# EAGLE design aspirin (EAGLE 6.1)
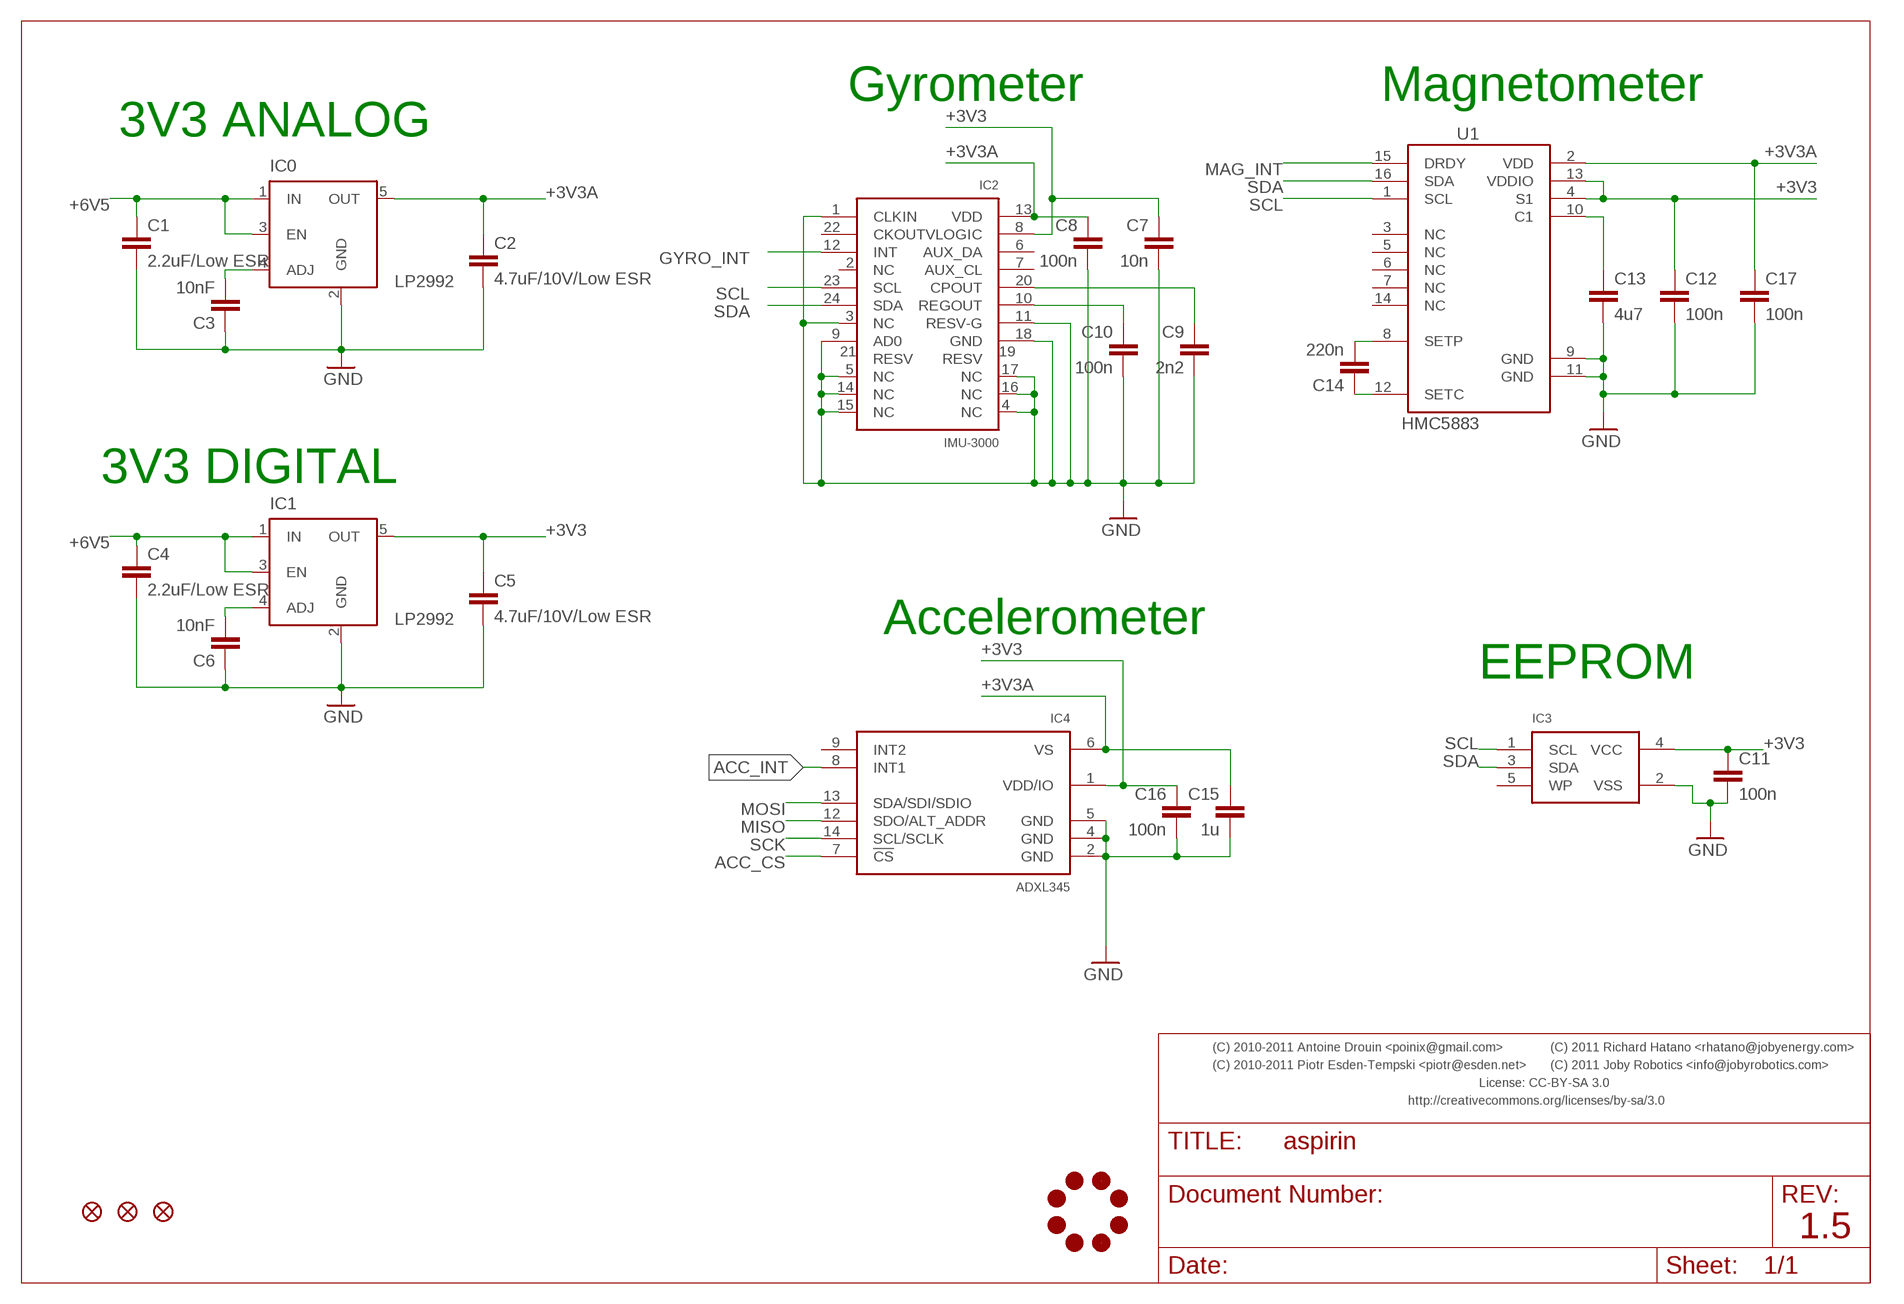
[diagram p0: schematic, sheet 1]

## Parts
C1  2.2uF/Low ESR  CAPACITOR-0603  [0603-CAP]
C2  4.7uF/10V/Low ESR  CAPACITOR-0402  [0402-CAP]
C3  10nF  CAPACITOR-0402  [0402-CAP]
C4  2.2uF/Low ESR  CAPACITOR-0603  [0603-CAP]
C5  4.7uF/10V/Low ESR  CAPACITOR-0402  [0402-CAP]
C6  10nF  CAPACITOR-0402  [0402-CAP]
C7  10n  CAPACITOR-0402  [0402-CAP]
C8  100n  CAPACITOR-0402  [0402-CAP]
C9  2n2  CAPACITOR-0402  [0402-CAP]
C10  100n  CAPACITOR-0402  [0402-CAP]
C11  100n  CAPACITOR-0402  [0402-CAP]
C12  100n  CAPACITOR-0402  [0402-CAP]
C13  4u7  CAPACITOR-0402  [0402-CAP]
C14  220n  CAPACITOR-0402  [0402-CAP]
C15  1u  CAPACITOR-0402  [0402-CAP]
C16  100n  CAPACITOR-0402  [0402-CAP]
C17  100n  CAPACITOR-0402  [0402-CAP]
IC0  LP2992  MIC5219BM5  [SOT23-5]
IC1  LP2992  MIC5219BM5  [SOT23-5]
IC2  IMU-3000  [QFN24-IMU3000]
IC3  I2C_EEPROM-SOT23-5  [SOT23-5]
IC4  ADXL345  [LGA-14]
JL2  JOBY_LOGO-6MIL  [JOBY_LOGO_6MIL]
JP1  FIDUCIAL1X2  [FIDUCIAL-1X2]
JP2  FIDUCIAL1X2  [FIDUCIAL-1X2]
JP3  FIDUCIAL1X2  [FIDUCIAL-1X2]
U1  HMC5883  [PLCC16-HMC5883]

## Nets
+3V3: C5.P$1 C7.P$1 C11.P$1 C12.P$1 C16.P$1 IC1.5(OUT) IC2.8(VLOGIC) IC3.4(VCC) IC4.1(VDD/IO) U1.4(S1) U1.13(VDDIO)
+3V3A: C2.P$1 C8.P$1 C15.P$1 C17.P$1 IC0.5(OUT) IC2.13(VDD) IC4.6(VS) U1.2(VDD)
+6V5: C1.P$1 C4.P$1 IC0.1(IN) IC0.3(EN) IC1.1(IN) IC1.3(EN)
ACC_CS: IC4.7(!CS)
ACC_INT: IC4.8(INT1)
GND: C1.P$2 C2.P$2 C3.P$1 C4.P$2 C5.P$2 C6.P$1 C7.P$2 C8.P$2 C9.P$2 C10.P$2 C11.P$2 C12.P$2 C13.P$2 C15.P$2 C16.P$2 C17.P$2 IC0.2(GND) IC1.2(GND) IC2.1(CLKIN) IC2.3(NC) IC2.4(NC) IC2.5(NC) IC2.9(AD0) IC2.11(RESV-G) IC2.14(NC) IC2.15(NC) IC2.16(NC) IC2.17(NC) IC2.18(GND) IC3.2(VSS) IC4.2(GND) IC4.4(GND) IC4.5(GND) U1.9(GND) U1.11(GND)
GYRO_INT: IC2.12(INT)
MAG_INT: U1.15(DRDY)
MISO: IC4.12(SDO/ALT_ADDR)
MOSI: IC4.13(SDA/SDI/SDIO)
N$1: C9.P$1 IC2.20(CPOUT)
N$2: C10.P$1 IC2.10(REGOUT)
N$3: C13.P$1 U1.10(C1)
N$19: C6.P$2 IC1.4(ADJ)
N$23: C3.P$2 IC0.4(ADJ)
N$34: C14.P$2 U1.8(SETP)
N$48: C14.P$1 U1.12(SETC)
SCK: IC4.14(SCL/SCLK)
SCL: IC2.23(SCL) IC3.1(SCL) U1.1(SCL)
SDA: IC2.24(SDA) IC3.3(SDA) U1.16(SDA)
Unconnected: IC2.2(NC) IC2.6(AUX_DA) IC2.7(AUX_CL) IC2.19(RESV) IC2.21(RESV) IC2.22(CKOUT) IC3.5(WP) IC4.9(INT2) U1.3(NC) U1.5(NC) U1.6(NC) U1.7(NC) U1.14(NC)

## Notes on the sheet
- Gyrometer | Magnetometer
- 3V3 ANALOG
- 3V3 DIGITAL
- Accelerometer
- EEPROM
- (C) 2010-2011 Antoine Drouin <poinix@gmail.com> | (C) 2011 Richard Hatano <rhatano@jobyenergy.com>
- (C) 2010-2011 Piotr Esden-Tempski <piotr@esden.net> | (C) 2011 Joby Robotics <info@jobyrobotics.com>
- License: CC-BY-SA 3.0
- http://creativecommons.org/licenses/by-sa/3.0
- 1.5

## Library data of the parts
C1-C17 = pel_dipol_comp:CAPACITOR
IC0 IC1 = v-reg-micrel:MIC5219BM5: VOLTAGE REGULATOR
IC2 = aspirin:IMU-3000
IC3 = aspirin:I2C_EEPROM
IC4 = aspirin:ADXL345
JL2 = aspirin:JOBY_LOGO
JP1-JP3 = aspirin:FIDUCIAL: Fiducial Alignment Points Various fiducial points for machine vision alignment.
U1 = aspirin:HMC5883

## Board
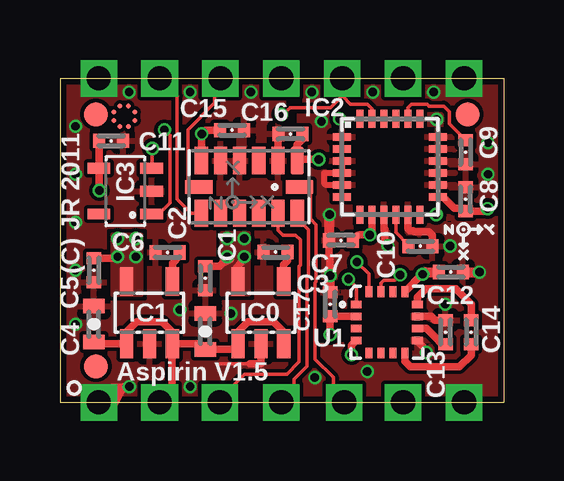
[diagram p1: board, top side]
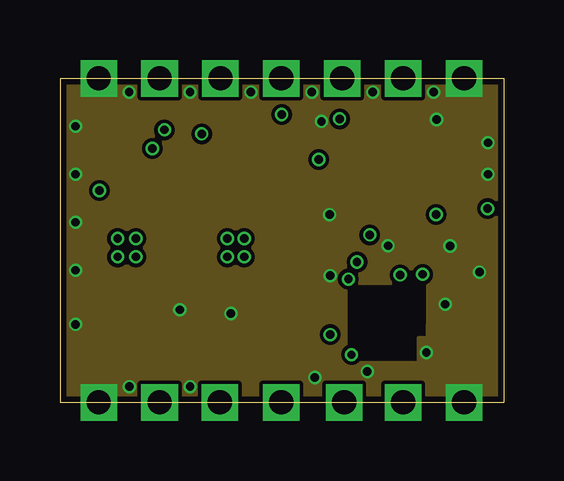
[diagram p2: board, inner layer Route2]
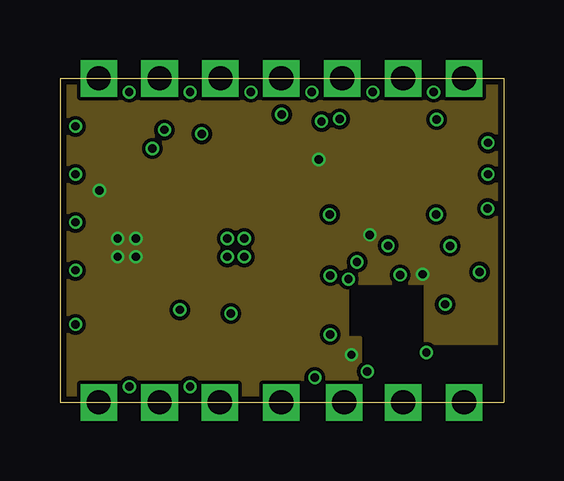
[diagram p3: board, inner layer Route15]
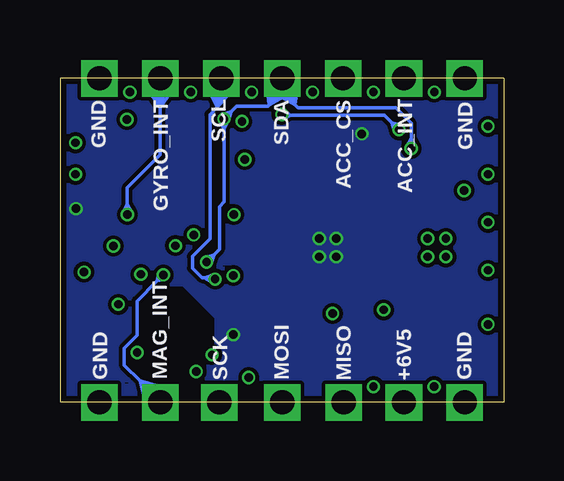
[diagram p4: board, bottom side, seen from below]

Size 18.5 x 13.5 mm. Coordinates in mm from the lower left corner, seen from the top.
Outline: 0,13.5 0,0 18.5,0 18.5,13.5 0,13.5
Copper layers (1*2+15*16): Top 0.035mm / dielectric 0.2mm / Route2 0.035mm / dielectric 1.5mm / Route15 0.035mm / dielectric 0.2mm / Bottom 0.035mm
Design rules: minimum track width 0.15mm, minimum drill 0.35mm, track to track 6mil, track to pad 6mil, pad to pad 6mil, via to via 6mil, smd to smd 6mil, copper to edge 10mil, drill to drill 8mil, minimum pad ring 0.1mm, minimum via ring 0.1mm, stop-mask expansion 4mil, vias tented up to drill 0.35mm, thermal gap 10mil
tRestrict: area 8.5,6.7 to 8.7,6.7; area 16.2,7.5 to 16.3,7.5; area 12.3,8.4 to 15.2,11.2; area 9.8,11.8 to 9.9,11.9; area 11.7,2.5 to 11.8,2.5; area 12.7,2.3 to 14.6,4.3; area 11.7,4.5 to 11.7,4.7
bRestrict: area 11.6,5.7 to 11.7,5.7; area 15.7,0.8 to 15.8,0.8; area 12.1,1.8 to 15,4.7
vRestrict: area 12.7,2.3 to 14.6,4.3

### Footprints (pad centres in the part's own frame; a part is rotated, then mirrored left to right if it is on the bottom)
0603-CAP = smd 0.6 x 0.9: P$1 -0.75,0; P$2 0.75,0
0402-CAP = smd 0.5 x 0.6: P$1 -0.5,0; P$2 0.5,0
SOT23-5 = smd 0.55 x 1.2: 1 -0.95,-1.3; 2 0,-1.3; 3 0.95,-1.3; 4 0.95,1.3; 5 -0.95,1.3
QFN24-IMU3000 = smd 0.75 x 0.3: 1 -2,1.25; 2 -2,0.75; 3 -2,0.25; 4 -2,-0.25; 5 -2,-0.75; 6 -2,-1.25; 13 2,-1.25; 14 2,-0.75; 15 2,-0.25; 16 2,0.25; 17 2,0.75; 18 2,1.25 | smd 0.3 x 0.75: 7 -1.25,-2; 8 -0.75,-2; 9 -0.25,-2; 10 0.25,-2; 11 0.75,-2; 12 1.25,-2; 19 1.25,2; 20 0.75,2; 21 0.25,2; 22 -0.25,2; 23 -0.75,2; 24 -1.25,2
SOT23-5' = smd 0.45 x 0.95: 1 0.95,1.1; 2 0,1.1; 3 -0.95,1.1; 4 -0.95,-1.1; 5 0.95,-1.1
LGA-14 = smd 1.145 x 0.55: 1 -1.097,2; 2 -1.097,1.2; 3 -1.097,0.4; 4 -1.097,-0.4; 5 -1.097,-1.2; 6 -1.097,-2; 8 1.097,-2; 9 1.097,-1.2; 10 1.097,-0.4; 11 1.097,0.4; 12 1.097,1.2; 13 1.097,2 | smd 0.55 x 1.145: 7 0,-2.098; 14 0,2.098
JOBY_LOGO_6MIL = smd 0.203 x 0.203: 1 -0.178,0.432; 2 0.178,0.432; 3 0.432,0.178; 4 0.432,-0.178; 5 0.178,-0.432; 6 -0.178,-0.432; 7 -0.432,-0.178; 8 -0.432,0.178
FIDUCIAL-1X2 = smd 1 x 1: 1 0,0
PLCC16-HMC5883 = smd 0.45 x 0.3: 1 -1.275,0.75; 2 -1.275,0.25; 3 -1.275,-0.25; 4 -1.275,-0.75; 9 1.275,-0.75; 10 1.275,-0.25; 11 1.275,0.25; 12 1.275,0.75 | smd 0.3 x 0.45: 5 -0.75,-1.275; 6 -0.25,-1.275; 7 0.25,-1.275; 8 0.75,-1.275; 13 0.75,1.275; 14 0.25,1.275; 15 -0.25,1.275; 16 -0.75,1.275

### Placement (x,y rotation side)
C1  6.06,2.95 90 top
C2  6.06,5.16 270 top
C3  9,6.26 0 top
C4  1.42,3.26 90 top
C5  1.42,5.49 270 top
C6  4.5,6.25 0 top
C7  11.72,6.75 180 top
C8  16.92,8.47 90 top
C9  16.92,10.42 270 top
C10  15.04,6.5 0 top
C11  2.13,10.9 0 top
C12  16.31,5.43 0 top
C13  16.08,2.93 90 top
C14  17.15,2.93 270 top
C15  7.18,11.34 0 top
C16  9.62,11.18 180 top
C17  11.27,4.09 90 top
DRILEGEND  [DRILEGEND]  -1.02,-7.68 0 top  (outside the outline)
IC0  8.38,3.73 0 top
IC1  3.73,3.73 0 top
IC2  13.76,9.8 0 top
IC3  [SOT23-5']  2.73,8.8 270 top
IC4  7.89,8.97 270 top
JL2  2.69,11.92 0 top
JP1  1.5,12 0 top
JP2  17,12 0 top
JP3  1.5,1.5 0 top
U1  13.63,3.33 0 top

### Tracks (layer width: path | path; a pad name or v marks a point on that pad's centre or on a via)
+3V3  (via drill 0.35)
  Top 0.305: v10.79,10.12 9.94,10.12 IC4.1 9.89,10.73 10.12,10.96 C16.P$1 | v1.64,8.82 1.64,9.73 IC3.4 1.63,10.89 C11.P$1 | C7.P$1 12.42,6.95 12.5,6.98 v12.92,6.98 | v12.92,6.98 13.01,7.07 | C5.P$1 2.34,5.99 v2.41,6.06 | U1.13 14.39,4.61 15.1,5.33 v15.13,5.33 | v12.16,1.98 12.16,2.38 U1.4 | IC2.8 13.01,7.06 v12.92,6.98
  Top 0.406: C12.P$1 15.22,5.42 v15.13,5.33
  other vias: 3.17,6.06 2.41,6.83 3.17,6.83
  pour Route15: 0,0 18.52,0 18.52,2.5 14.92,2.5 14.92,1.65 12.52,1.65 12.52,2.65 11.97,2.65 11.97,5 15.27,5 15.27,4.4 18.5,4.4 18.5,13.5 0,13.5
  pour Top (no thermals): 3.4,4.46 2.18,4.46 2.18,7 3.4,7
  pour Route15: 18.52,2.5 18.52,4.4 15.27,4.4 15.27,2.5
+3V3A  (via drill 0.35)
  Top 0.305: v7.69,6.06 7.52,5.77 | 7.52,5.77 7.36,5.61 | C2.P$1 6.65,5.66 6.76,5.77 | 6.76,5.77 v6.98,6.06 | 17.43,7.97 C8.P$1 16.92,8.02 16.86,8.08 16.45,8.08 15.97,8.55 IC2.13 | 17.43,7.97 17.73,7.97 v17.83,8.07 17.83,7.95 17.43,7.97 | 6.76,5.77 7.11,5.96 v6.98,6.06 | 6.76,5.77 6.95,6.12 v6.98,6.06 | v7.69,6.06 7.75,5.96 | 7.52,5.77 7.71,6.12 v7.69,6.06 | U1.2 11.31,3.58 C17.P$1 v11.27,2.82 | IC4.6 5.9,10.1 v5.9,11.17 v5.91,11.18 6.06,11.34 C15.P$1
  other vias: 7.69,6.83 6.98,6.83
  pour Bottom: 18.5,0 18.5,13.5 0,13.5 0,0
  pour Top (no thermals): 7.89,4.48 6.75,4.48 6.75,7.07 7.89,7.07
+6V5  (via drill 1.02)
  Top 0.305: IC0.3 9.33,2.94 8.92,3.35 7.85,3.35 7.43,2.94 IC0.1 7.2,2.2 C1.P$1 5.83,2.43 IC1.3 | IC1.3 4.68,2.94 4.27,3.35 3.2,3.35 2.78,2.94 IC1.1 1.49,2.43 C4.P$1 | IC1.3 4.68,0.53 v4.16,0
ACC_CS  (via drill 1.02)
  Top 0.152: v6.7,13.5 6.46,13.26 6.46,12.47 5.33,11.35 5.33,9.16 5.52,8.97 IC4.7
ACC_INT  (via drill 1.02)
  Top 0.152: IC4.8 5.47,7.88 4.89,8.46 4.89,12.76 v4.16,13.5
GND  (via drill 0.35, 1.02)
  Top 0.152: 6.68,1.6 7.93,1.6
  Top 0.254: IC2.3 IC2.4 11.01,9.55 11.01,9.12 11.07,9.07 11.75,9.07
  Top 0.305: 2.65,0.65 v2.89,0.65 | 2.65,0.65 2.63,0.65 | IC0.2 8.38,1.6 7.93,1.6 | C16.P$2 9.09,11.05 IC4.2 | IC2.9 13.51,7.26 13.55,7.21 | 13.55,6.92 13.55,6.65 v13.68,6.52 13.56,6.52 13.55,6.92 | 13.55,6.92 13.55,7.21 | 13.55,7.21 13.53,7.21 13.5,7.19 | 2.65,0.65 1.59,0.61 v1.62,0 2.16,-0.28 2.65,0.65 | IC2.11 14.51,7.23 14.6,7.14 14.75,7.14 14.77,7.11 15.38,7.11 15.54,6.96 C10.P$2 | v11.27,5.28 11.27,6.02 11.22,6.07 C7.P$2 | U1.9 14.91,2.54 15.28,2.16 15.28,2.08 | U1.11 15.49,3.58 15.64,3.43 C13.P$2
  Top 0.406: C12.P$2 v17.49,5.42 | C17.P$2 v11.27,5.28 | v11.24,7.82 11.24,6.78 C7.P$2
  other vias: 5,3.85 7.13,3.7 17.85,9.5 17.85,10.81 16.27,6.51 0.65,3.25 0.65,5.5 0.65,7.5 0.65,9.5 0.65,11.5 2.89,12.92 5.43,12.92 7.97,12.92 13.05,12.92 15.59,12.92 10.63,1.03 5.43,0.65 1.62,13.5 16.86,13.5 16.86,0 10.51,12.92 15.71,11.78 10.91,11.7 16.07,4.08 12.82,1.28 15.28,2.07
  pour Top (rank 6): 0,0 18.5,0 18.5,13.5 0,13.5
  pour Route2: 0,0 18.52,0 18.52,2.65 14.97,2.65 14.97,1.6 11.92,1.6 11.92,5 15.32,5 15.32,4.95 15.37,4.95 15.37,3.3 18.52,3.3 18.5,13.5 0,13.5
  pour Route2: 18.52,2.65 15.37,2.65 15.37,3.25 18.52,3.25
GYRO_INT  (via drill 0.35, 1.02)
  Top 0.152: IC2.12 15.67,7.8 v15.69,7.82
  Bottom 0.152: v15.69,7.82 15.69,8.24 | 15.69,8.24 15.69,8.94 14.32,10.31 14.32,12.28 | 14.32,12.28 14.32,12.34 | 14.32,12.34 v14.32,13.5 | 14.32,12.28 14.88,13.11 v14.32,13.5 | 14.32,12.28 13.75,13.11 v14.32,13.5 | 15.69,8.24 15.51,7.92 v15.69,7.82 | 15.69,8.24 15.86,7.92 v15.69,7.82 | 14.32,12.34 14.11,12.93 | 14.32,12.34 14.52,12.88
MAG_INT  (via drill 0.35, 1.02)
  Top 0.152: U1.15 13.38,4.96 13.5,5.08 13.96,5.08 v14.19,5.31
  Bottom 0.152: v14.19,5.31 14.44,5.05 | 14.44,5.05 14.37,5.38 v14.19,5.31 | 14.44,5.05 14.11,5.13 v14.19,5.31 | v14.32,0 14.32,0.05 14.34,0.08 | 15.15,0.89 14.34,0.08 | 15.15,0.89 15.82,1.55 15.82,2.26 15.28,2.79 15.28,4.22 14.44,5.05 | 15.15,0.89 15,0.3 14.34,0.08 | 15.15,0.89 14.44,0.69 14.34,0.08
MISO  (via drill 1.02)
  Top 0.152: v6.67,0 6.67,0.15 7.69,1.18 9.47,1.18 9.98,1.68 9.98,5.67 10.03,5.72 10.03,6.76 9.83,6.96 9.3,6.96 9.09,7.16 IC4.12
MOSI  (via drill 1.02)
  Top 0.152: IC4.13 9.89,7.66 10.36,7.2 10.36,5.31 10.3,5.26 10.3,1.5 9.75,0.95 9.75,0.51 v9.24,0
N$1
  Top 0.152: C9.P$1 16.23,11.61 16.23,12.12 16,12.34 15.39,12.34 15.32,12.42 14.66,12.42 14.51,12.27 IC2.20
N$2
  Top 0.152: IC2.10 14.01,7.08 14.54,6.55 C10.P$1
N$3
  Top 0.305: U1.10 15.28,3.08 15.46,2.9 15.61,2.74 15.93,2.43 C13.P$1
N$19
  Top 0.305: C6.P$2 5,6.1 4.69,5.79 IC1.4
N$23
  Top 0.305: IC0.4 9.33,5.73 9.5,5.9 C3.P$2
N$34
  Top 0.305: C14.P$2 17.15,1.97 16.65,1.47 14.62,1.47 14.38,1.71 U1.8
N$48
  Top 0.305: U1.12 14.9,4.37 15.26,4.72 16.5,4.72 17.15,4.08 C14.P$1
SCK  (via drill 1.02)
  Top 0.152: v11.85,0 11.4,0.45 11.4,1.04 10.64,1.8 10.63,1.8 10.63,4.98 10.69,5.03 10.69,7.4 10.44,7.65 10.44,8.83 10.3,8.97 IC4.14
SCL  (via drill 0.35, 1.02)
  Top 0.152: v9.25,11.99 9.59,12.26 9.6,12.27 11.28,12.27 11.78,12.77 | IC3.1 4.13,7.84 4.59,8.31 4.59,11.12 v4.36,11.35 | 11.78,12.77 v11.78,13.5 | 11.78,12.77 12.12,12.42 12.82,12.42 13.01,12.23 IC2.23 | U1.1 12.36,4.75 12.3,4.81 12.3,4.86 v12.03,5.13
  Bottom 0.152: v11.78,13.5 11.78,12.46 11.94,12.29 | 11.94,12.29 12.24,11.99 12.24,6.81 12.97,6.08 12.97,5.59 12.57,5.19 12.45,5.19 | v4.36,11.35 4.66,11.65 | 4.66,11.65 4.97,11.96 8.88,11.96 | 8.88,11.96 v9.25,11.99 | 12.45,5.19 12.39,5.13 v12.03,5.13 | 4.66,11.65 4.3,11.54 v4.36,11.35 | 4.66,11.65 4.55,11.3 v4.36,11.35 | 11.96,12.32 11.94,12.29 | 11.96,12.32 12.39,13.19 v11.78,13.5 | 11.72,12.54 11.94,12.29 | 11.72,12.54 11.27,13.04 v11.78,13.5 | 8.88,11.96 9.15,11.81 v9.25,11.99 | 8.88,11.96 9.15,12.16 v9.25,11.99 | 12.45,5.19 12.1,5.32 v12.03,5.13 | 12.45,5.19 12.15,4.97 v12.03,5.13 | 11.72,12.54 11.6,12.98 | 11.96,12.32 11.85,12.98 | 11.96,12.32 12.08,13.01
SDA  (via drill 0.35, 1.02)
  Top 0.152: v11.66,11.81 IC2.24 | IC3.3 3.85,9.77 v3.85,10.57 | U1.16 12.88,5.35 v12.39,5.84
  Bottom 0.152: 11.36,12.11 11.13,12.34 9.83,12.34 9.77,12.4 | 11.36,12.11 v11.66,11.81 | 9.24,12.94 9.75,12.43 | 9.75,12.43 9.77,12.4 | v9.24,13.5 9.24,12.94 | v3.85,10.57 3.85,10.99 | 3.85,10.99 3.85,11.63 4.5,12.27 8.57,12.27 8.7,12.4 | 8.7,12.4 8.74,12.44 | 8.74,12.44 9.24,12.94 | 11.65,11.39 v11.65,11.8 v11.66,11.81 | 11.65,11.39 11.65,8.36 11.85,8.15 11.85,6.38 12.08,6.15 | 3.85,10.99 3.68,10.67 v3.85,10.57 | 3.85,10.99 4.03,10.67 v3.85,10.57 | 9.77,12.4 9.78,12.44 | 9.78,12.44 9.92,13.4 v9.24,13.5 | 9.77,12.4 8.9,12.9 v9.24,13.5 | 8.7,12.4 9.58,12.9 v9.24,13.5 | 8.7,12.4 8.56,13.4 v9.24,13.5 | 11.36,12.11 11.47,11.75 v11.66,11.81 | 11.36,12.11 11.72,12 v11.66,11.81 | 11.65,11.39 11.83,11.71 v11.66,11.81 | 11.65,11.39 11.48,11.72 v11.66,11.81 | 8.74,12.44 8.91,12.88 | 8.74,12.44 8.78,12.9 | 9.78,12.44 9.54,12.88 | 9.75,12.43 9.69,12.88 | 12.08,6.15 12.11,6.12 | 12.11,6.12 v12.39,5.84 | 12.11,6.12 12.46,6.02 v12.39,5.84 | 12.08,6.15 12.21,5.77 v12.39,5.84

### Text on the board
tPlace: (C) JR 2011 | Aspirin V1.5
bPlace: GND | ACC_INT | ACC_CS | SDA | SCL | GYRO_INT | GND | GND | +6V5 | MISO | MOSI | SCK | MAG_INT | GND